# EAGLE design MiniDuino (EAGLE 6.5.0)
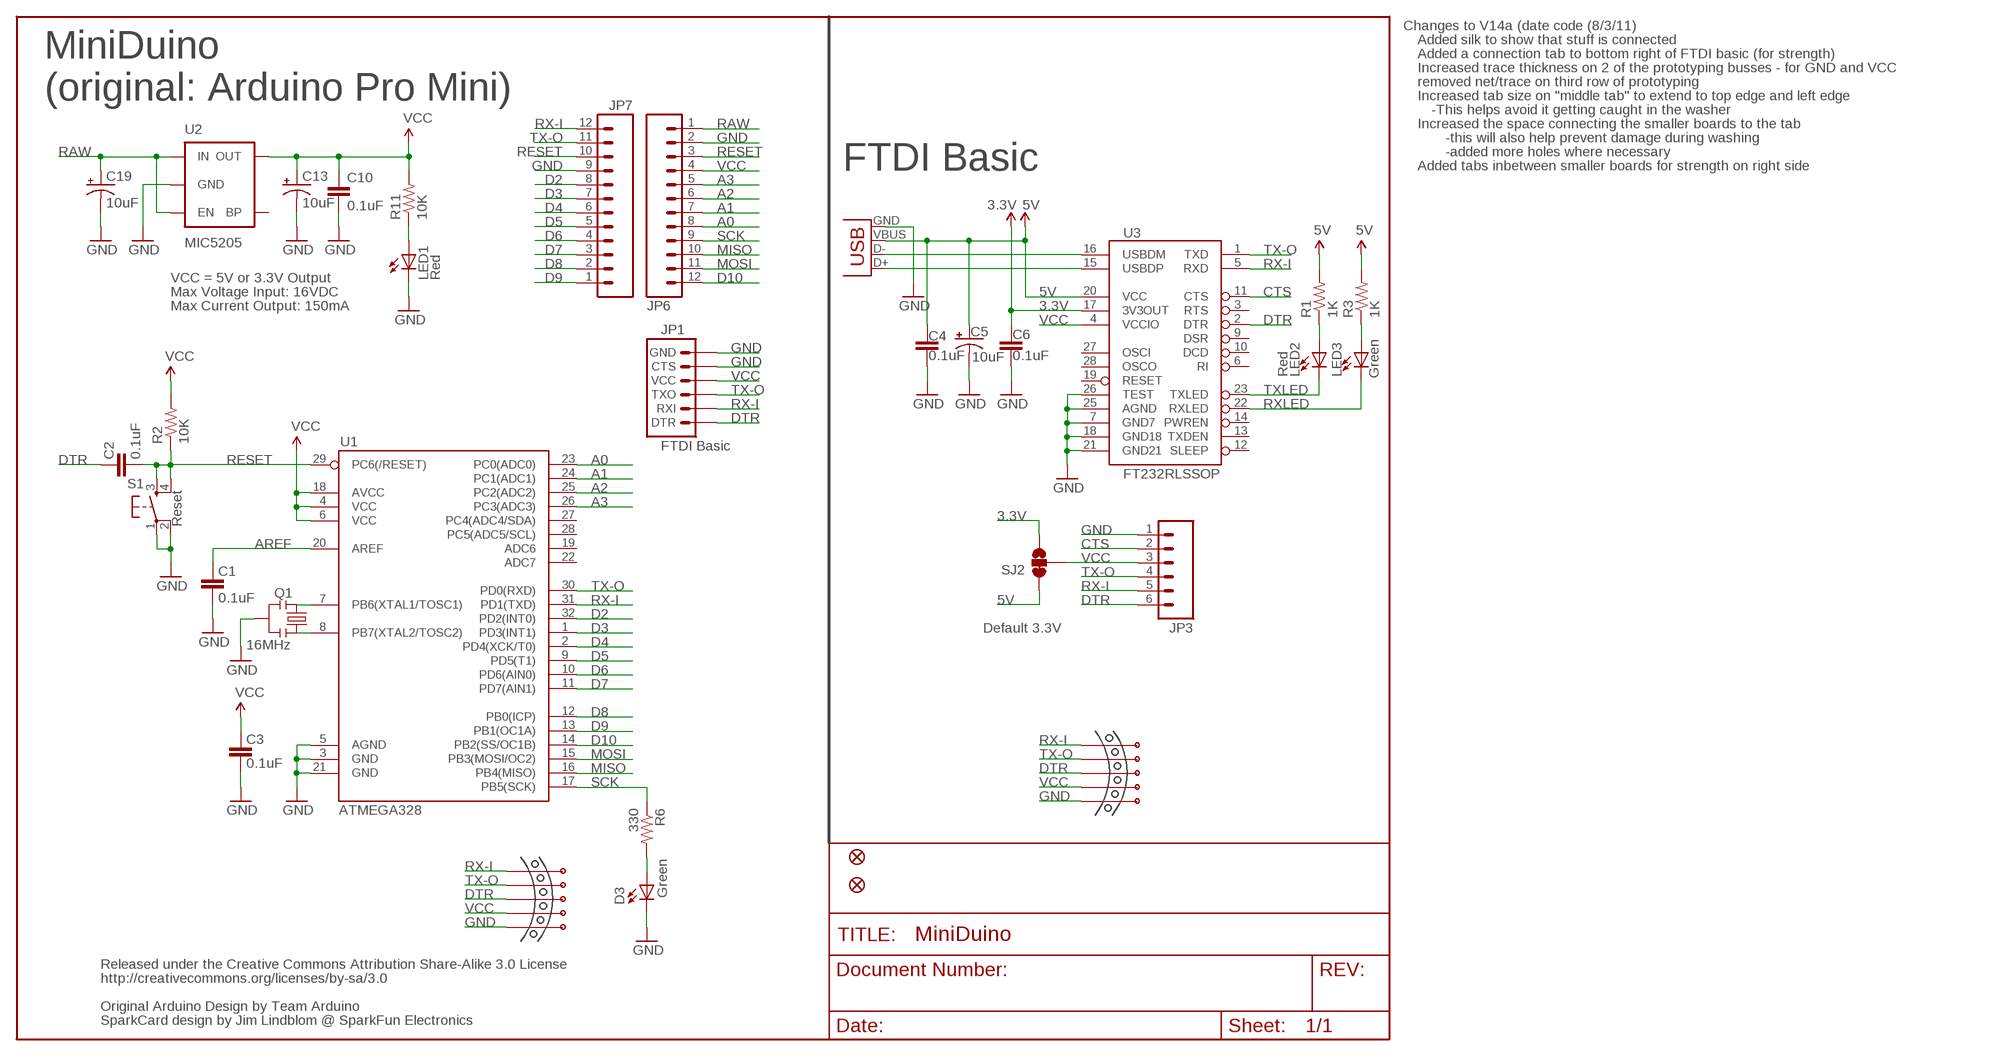
[diagram p0: schematic, sheet 1]

## Parts
C1  0.1uF  CAP0402-CAP  [0402-CAP]
C2  0.1uF  CAP0402-CAP  [0402-CAP]
C3  0.1uF  CAP0402-CAP  [0402-CAP]
C4  0.1uF  CAP0402-CAP  [0402-CAP]
C5  10uF  CAP_POL1206  [EIA3216]
C6  0.1uF  CAP0402-CAP  [0402-CAP]
C10  0.1uF  CAP0402-CAP  [0402-CAP]
C13  10uF  CAP_POL1206  [EIA3216]
C19  10uF  CAP_POL1206  [EIA3216]
D3  Green  LED0603  [LED-0603]
JP1  FTDI Basic  ARDUINO_SERIAL_PROGRAMPTH  [1X06]
JP3  M06SIP  [1X06]
JP6  M12PTH  [1X12]
JP7  M12PTH  [1X12]
JP16  FIDUCIAL1X2.5  [FIDUCIAL-1X2.5]
JP19  FIDUCIAL1X2.5  [FIDUCIAL-1X2.5]
LED1  Red  LED0603  [LED-0603]
LED2  Red  LED0603  [LED-0603]
LED3  Green  LED0603  [LED-0603]
Q1  16MHz  RESONATORSMD  [RESONATOR-SMD]
R1  1K  RESISTOR0402-RES  [0402-RES]
R2  10K  RESISTOR0402-RES  [0402-RES]
R3  1K  RESISTOR0402-RES  [0402-RES]
R6  330  RESISTOR0402-RES  [0402-RES]
R11  10K  RESISTOR0402-RES  [0402-RES]
S1  Reset  TAC_SWITCHSMD  [TACTILE_SWITCH_SMD]
SJ2  SOLDERJUMPER_2WAYS  [SJ_3]
U1  ATMEGA328  ATMEGA168  [TQFP32-08]
U2  MIC5205  V_REG_LDOSMD  [SOT23-5]
U3  FT232RLSSOP  [SSOP28DB]
U$22  MOUSE-BITE-5  [MOUSE-BITE-5]
U$23  MOUSE-BITE-5  [MOUSE-BITE-5]
X2  USB-SMD-NS  [USB-MINIB-NOSTOP]

## Nets
3.3V [power]: C6.1 SJ2.3 U3.17(3V3OUT)
5V: C4.1 C5.A(+) R1.2 R3.2 SJ2.1 U3.20(VCC) X2.VBUS
A0: JP6.8 U1.23(PC0(ADC0))
A1: JP6.7 U1.24(PC1(ADC1))
A2: JP6.6 U1.25(PC2(ADC2))
A3: JP6.5 U1.26(PC3(ADC3))
AREF: C1.2 U1.20(AREF)
CTS: JP3.2 U3.11(CTS)
D2: JP7.8 U1.32(PD2(INT0))
D3: JP7.7 U1.1(PD3(INT1))
D4: JP7.6 U1.2(PD4(XCK/T0))
D5: JP7.5 U1.9(PD5(T1))
D6: JP7.4 U1.10(PD6(AIN0))
D7: JP7.3 U1.11(PD7(AIN1))
D8: JP7.2 U1.12(PB0(ICP))
D9: JP7.1 U1.13(PB1(OC1A))
D10: JP6.12 U1.14(PB2(SS/OC1B))
DTR: C2.2 JP1.1(DTR) JP3.6 U3.2(DTR) U$22.P$3 U$23.P$3
GND [power]: C1.1 C3.1 C4.2 C5.C(-) C6.2 C10.2 C13.C(-) C19.C(-) D3.C JP1.5(CTS) JP1.6(GND) JP3.1 JP6.2 JP7.9 LED1.C Q1.2 S1.1 S1.2 U1.3(GND) U1.5(AGND) U1.21(GND) U2.2(GND) U3.7(GND7) U3.18(GND18) U3.21(GND21) U3.25(AGND) U3.26(TEST) U$22.P$5 U$23.P$5 X2.GND
MISO: JP6.10 U1.16(PB4(MISO))
MOSI: JP6.11 U1.15(PB3(MOSI/OC2))
N$1: Q1.1 U1.8(PB7(XTAL2/TOSC2))
N$2: Q1.3 U1.7(PB6(XTAL1/TOSC1))
N$3: LED2.A R1.1
N$4: LED3.A R3.1
N$7: D3.A R6.2
N$38: LED1.A R11.1
RAW [power]: C19.A(+) JP6.1 U2.1(IN) U2.3(EN)
RESET: C2.1 JP6.3 JP7.10 R2.1 S1.3 S1.4 U1.29(PC6(/RESET))
RX-I: JP1.2(RXI) JP3.5 JP7.12 U1.31(PD1(TXD)) U3.5(RXD) U$22.P$1 U$23.P$1
RXLED: LED3.C U3.22(RXLED)
SCK: JP6.9 R6.1 U1.17(PB5(SCK))
TX-O: JP1.3(TXO) JP3.4 JP7.11 U1.30(PD0(RXD)) U3.1(TXD) U$22.P$2 U$23.P$2
TXLED: LED2.C U3.23(TXLED)
USB_D+: U3.15(USBDP) X2.D+
USB_D-: U3.16(USBDM) X2.D-
VCC: C3.2 C10.1 C13.A(+) JP1.4(VCC) JP3.3 JP6.4 R2.2 R11.2 SJ2.2 U1.4(VCC) U1.6(VCC) U1.18(AVCC) U2.5(OUT) U3.4(VCCIO) U$22.P$4 U$23.P$4
Unconnected: U1.19(ADC6) U1.22(ADC7) U1.27(PC4(ADC4/SDA)) U1.28(PC5(ADC5/SCL)) U2.4(BP) U3.3(RTS) U3.6(RI) U3.9(DSR) U3.10(DCD) U3.12(SLEEP) U3.13(TXDEN) U3.14(PWREN) U3.19(RESET) U3.27(OSCI) U3.28(OSCO)

## Notes on the sheet
- Changes to V14a (date code (8/3/11)
- Added silk to show that stuff is connected
- Added a connection tab to bottom right of FTDI basic (for strength)
- Increased trace thickness on 2 of the prototyping busses - for GND and VCC
- removed net/trace on third row of prototyping
- MiniDuino
  (original: Arduino Pro Mini)
- Increased tab size on "middle tab" to extend to top edge and left edge
- -This helps avoid it getting caught in the washer
- Increased the space connecting the smaller boards to the tab
- -this will also help prevent damage during washing
- -added more holes where necessary
- FTDI Basic | Added tabs inbetween smaller boards for strength on right side
- VCC = 5V or 3.3V Output
- Max Voltage Input: 16VDC
- Max Current Output: 150mA
- Default 3.3V
- Released under the Creative Commons Attribution Share-Alike 3.0 License
- http://creativecommons.org/licenses/by-sa/3.0
- Original Arduino Design by Team Arduino
- SparkCard design by Jim Lindblom @ SparkFun Electronics

## Library data of the parts
C1-C4 C6 C10 = SparkFun:CAP: Capacitor Standard 0603 ceramic capacitor, and 0.1" leaded capacitor.
C5 C13 C19 = SparkFun:CAP_POL: Capacitor Polarized These are standard SMD and PTH capacitors. Normally 10uF, 47uF, and 100uF in electrolytic and tantalum varieties. Always verify the external diameter of the through hole cap, it varies with capacity, voltage, and manufacturer. The EIA devices should be standard.
D3 LED1-LED3 = SparkFun:LED: LEDs Standard schematic elements and footprints for 5mm, 3mm, 1206, and 0603 sized LEDs. 5mm - Spark Fun Electronics SKU : COM-00529 (and others)
JP1 = SparkFun:ARDUINO_SERIAL_PROGRAM
JP3 = SparkFun:M06: Header 6 Standard 6-pin 0.1" header. Use with straight break away headers (SKU : PRT-00116), right angle break away headers (PRT-00553), swiss pins (PRT-00743), machine pins (PRT-00117), and female headers (PRT-00115). Molex polarized connector foot print use with SKU : PRT-08094 with associated crimp pins and housings. NOTES ON THE VARIANTS LOCK and LOCK_LONGPADS... This footprint was designed to help hold the alignment of a through-hole component (i.e. 6-pin header) while soldering it into place. You may notice that each hole has been shifted either up or down by 0.005 of an inch from it's more standard position (which is a perfectly straight line). This slight alteration caused the pins (the squares in the middle) to touch the edges of the holes. Because they are alternating, it causes a "brace" to hold the component in place. 0.005 has proven to be the perfect amount of "off-center" position when using our standard breakaway headers. Although looks a little odd when you look at the bare footprint, once you have a header in there, the alteration is very hard to notice. Also, if you push a header all the way into place, it is covered up entirely on the bottom side. This idea of altering the position of holes to aid alignment will be further integrated into the Sparkfun Library for other footprints. It can help hold any component with 3 or more connection pins.
JP6 JP7 = SparkFun:M12: Header 12 Standard 12-pin 0.1" header. Use with straight break away headers (SKU : PRT-00116), right angle break away headers (PRT-00553), swiss pins (PRT-00743), machine pins (PRT-00117), and female headers (PRT-00115).
JP16 JP19 = abes:FIDUCIAL: Fiducial Alignment Points Various fiducial points for machine vision alignment.
Q1 = SparkFun:RESONATOR: Resonator Small SMD resonator. This is the itty bitty 10/20MHz resonators with built in caps. CSTCE10M0G55 and CSTCE20M0V53. Footprint has been reviewed closely but hasn't been tested yet.
R1-R3 R6 R11 = SparkFun:RESISTOR: Resistor Basic schematic elements and footprints for 0603, 1206, and PTH resistors.
S1 = SparkFun:TAC_SWITCH: Momentary Switch Button commonly used for reset or general input. Spark Fun Electronics SKU : COM-00097
SJ2 = SparkFun:SOLDERJUMPER_2WAY: Solder Jumper 2 way solder jumper
U1 = SparkFun:ATMEGA168
U2 = SparkFun:V_REG_LDO: Voltage Regulator LDO Standard 150mA LDO voltage regulator in SOT-23 layout. Micrel part MIC5205. BP (by-pass) pin is used to lower output noise with 470pF cap.
U3 = SparkFun:FT232RL: USB UART FT232RL 4th Generation USB UART (USB <-> Serial) Controller. Spark Fun Electronics SKU : COM-00650
U$22 U$23 = SparkFun:MOUSE-BITE-5
X2 = SparkFun:USB: USB Connectors USB-B-PTH is fully proven SKU : PRT-00139 USB-miniB is fully proven SKU : PRT-00587 USB-A-PCB is untested. USB-A-H is throughly reviewed, but untested. Spark Fun Electronics SKU : PRT-00437 USB-B-SMT is throughly reviewed, but untested. Needs silkscreen touching up. USB-A-S has not been used/tested USB-MB-H has not been used/tested

## Net classes
0 default: width 0.203 mm
1 power: width 0.254 mm

## Board
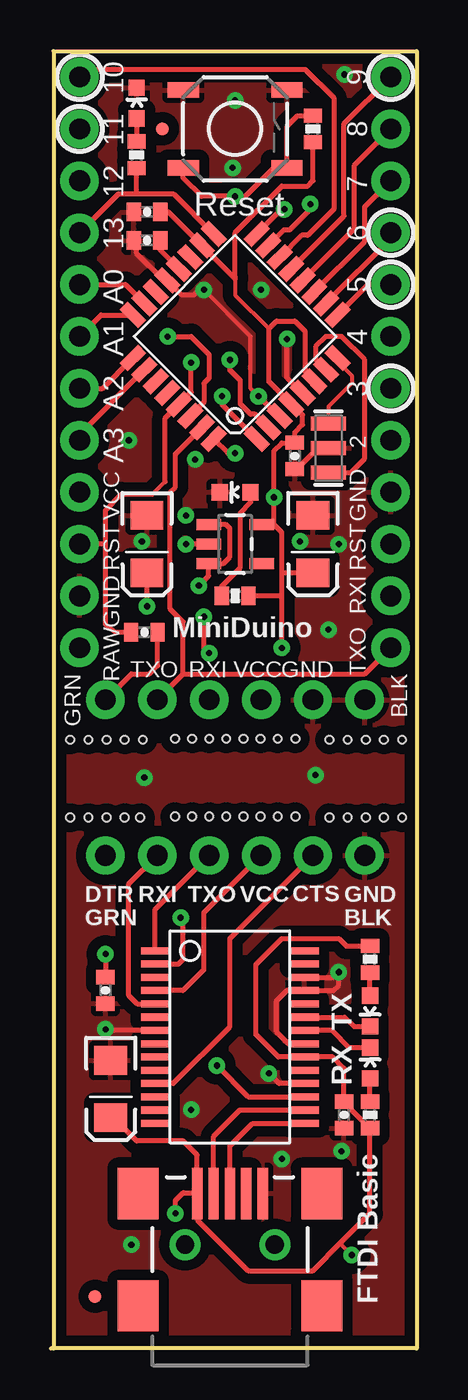
[diagram p1: board, top side]
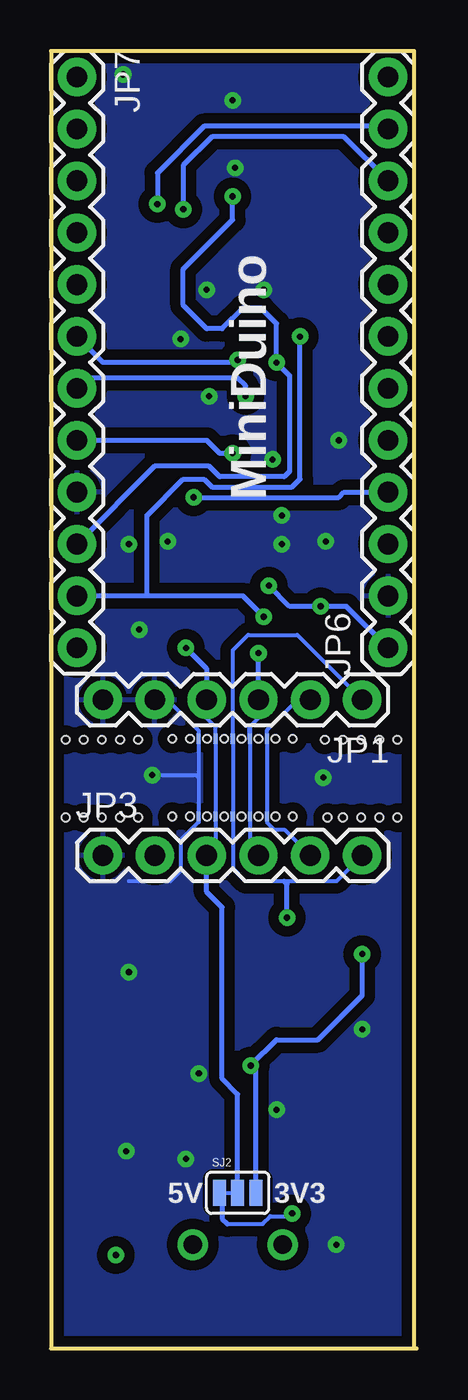
[diagram p2: board, bottom side, seen from below]

Size 17.91 x 63.5 mm. Coordinates in mm from the lower left corner, seen from the top.
Outline: 0.13,0 0.13,63.5 17.91,63.5 17.91,0 0,0
Copper layers (1*16): Top 0.035mm / dielectric 1.5mm / Bottom 0.035mm
Design rules "SparkFun *": minimum track width 8mil, minimum drill 20mil, track to track 8mil, track to pad 8mil, pad to pad 8mil, via to via 8mil, smd to smd 8mil, copper to edge 8mil, drill to drill 8mil, minimum pad ring 12mil, minimum via ring 10mil, stop-mask expansion 4mil, vias tented up to drill 20mil, thermal gap 10mil
Holes 0.38 mm at 0.94,29.79 1.83,29.79 2.72,29.79 3.61,29.79 4.5,29.79 0.94,25.98 1.83,25.98 2.72,25.98 3.61,25.98 4.37,25.98 17.2,29.79 16.31,29.79 15.42,29.79 14.53,29.79 13.64,29.79 17.2,25.98 16.31,25.98 15.42,25.98 14.53,25.98 13.64,25.98

### Footprints (pad centres in the part's own frame; a part is rotated, then mirrored left to right if it is on the bottom)
0402-CAP = smd 0.7 x 0.9: 1 -0.65,0; 2 0.65,0
EIA3216 = smd 1.4 x 1.6: A 1.4,0; C -1.4,0
LED-0603 = smd 0.8 x 0.8: A 0,-0.75; C 0,0.75
1X06 = drill 1.016 pad 1.88: 1 0,0; 2 2.54,0; 3 5.08,0; 4 7.62,0; 5 10.16,0; 6 12.7,0
1X12 = drill 1.016 pad 1.88: 1 0,0; 2 2.54,0; 3 5.08,0; 4 7.62,0; 5 10.16,0; 6 12.7,0; 7 15.24,0; 8 17.78,0; 9 20.32,0; 10 22.86,0; 11 25.4,0; 12 27.94,0
FIDUCIAL-1X2.5 = smd 0.635 x 0.635: 1 0,0
RESONATOR-SMD = smd 0.7 x 1.7: 1 -1.2,0; 2 0,0; 3 1.2,0
0402-RES = smd 0.7 x 0.9: 1 -0.65,0; 2 0.65,0
TACTILE_SWITCH_SMD = smd 1.524 x 0.762: 1 -2.54,1.905; 2 2.54,1.905; 3 -2.54,-1.905; 4 2.54,-1.905
SJ_3 = smd 0.635 x 1.27: 1 -0.889,0; 2 0,0; 3 0.889,0
TQFP32-08 = smd 1.27 x 0.559: 1 -4.293,2.8; 2 -4.293,2; 3 -4.293,1.2; 4 -4.293,0.4; 5 -4.293,-0.4; 6 -4.293,-1.2; 7 -4.293,-2; 8 -4.293,-2.8; 17 4.293,-2.8; 18 4.293,-2; 19 4.293,-1.2; 20 4.293,-0.4; 21 4.293,0.4; 22 4.293,1.2; 23 4.293,2; 24 4.293,2.8 | smd 0.559 x 1.27: 9 -2.8,-4.293; 10 -2,-4.293; 11 -1.2,-4.293; 12 -0.4,-4.293; 13 0.4,-4.293; 14 1.2,-4.293; 15 2,-4.293; 16 2.8,-4.293; 25 2.8,4.293; 26 2,4.293; 27 1.2,4.293; 28 0.4,4.293; 29 -0.4,4.293; 30 -1.2,4.293; 31 -2,4.293; 32 -2.8,4.293
SOT23-5 = smd 0.55 x 1.2: 1 -0.95,-1.3; 2 0,-1.3; 3 0.95,-1.3; 4 0.95,1.3; 5 -0.95,1.3
SSOP28DB = smd 0.348 x 1.397: 1 -4.225,-3.656; 2 -3.575,-3.656; 3 -2.925,-3.656; 4 -2.275,-3.656; 5 -1.625,-3.656; 6 -0.975,-3.656; 7 -0.325,-3.656; 8 0.325,-3.656; 9 0.975,-3.656; 10 1.625,-3.656; 11 2.275,-3.656; 12 2.925,-3.656; 13 3.575,-3.656; 14 4.225,-3.656; 15 4.225,3.656; 16 3.575,3.656; 17 2.925,3.656; 18 2.275,3.656; 19 1.625,3.656; 20 0.975,3.656; 21 0.325,3.656; 22 -0.325,3.656; 23 -0.975,3.656; 24 -1.625,3.656; 25 -2.275,3.656; 26 -2.925,3.656; 27 -3.575,3.656; 28 -4.225,3.656
MOUSE-BITE-5 = smd 0.203 x 0.508 bottom: P$1 -1.689,0; P$2 -0.851,0; P$3 -0.013,0; P$4 0.826,0; P$5 1.664,0 | hole 0.381: -2.108,0; -1.27,0; -0.432,0; 0.406,0; 1.245,0; 2.083,0; -2.946,0; 2.946,0
USB-MINIB-NOSTOP = smd 2.5 x 0.5: D+ 2.5,0; D- 2.5,0.8; GND 2.5,-1.6; ID 2.5,-0.8; VBUS 2.5,1.6 | smd 2.5 x 2: G1 -3,-4.5; G2 -3,4.5; G3 2.5,4.5; G4 2.5,-4.5 | drill 0.9 pad 0.8: H1 0,2.2 | drill 0.9 pad 0.787: H2 0,-2.2

### Placement (x,y rotation side)
C1  4.7,54.23 0 top
C2  4.57,35.05 0 top
C3  4.7,55.63 0 top
C4  14.35,11.43 270 top
C5  2.92,12.7 270 top
C6  2.67,17.53 270 top
C10  11.94,43.69 270 top
C13  12.83,39.37 270 top
C19  4.7,39.37 270 top
D3  4.19,60.96 0 top
JP1  2.67,31.75 180 bottom
JP3  15.37,24.13 0 bottom
JP6  1.4,34.29 90 bottom
JP7  16.64,62.23 270 bottom
JP16  2.16,2.54 0 top
JP19  5.46,59.69 0 top
LED1  9.02,41.91 90 top
LED2  15.62,16.51 180 top
LED3  15.62,13.97 0 top
Q1  13.59,44.07 270 top
R1  15.62,19.05 90 top
R2  12.83,59.69 270 top
R3  15.62,11.43 270 top
R6  4.19,58.42 90 top
R11  9.02,36.83 0 top
S1  9.02,59.69 0 top
SJ2  8.76,7.62 0 bottom
U1  9.02,49.53 135 top
U2  9.02,39.37 270 top
U3  8.76,15.24 270 top
U$22  9.02,29.84 0 top
U$23  9.02,26.04 0 top
X2  8.76,5.08 90 top

### Tracks (layer width: path | path; a pad name or v marks a point on that pad's centre or on a via)
3.3V  (via drill 0.3)
  Top 0.254: U3.17 9.66,12.31 v8.13,13.84 | v2.67,19.3 C6.1
  Bottom 0.254: SJ2.3 7.87,13.59 v8.13,13.84 6.86,15.11 4.83,15.11 2.67,17.27 v2.67,19.3
5V  (via drill 0.3)
  Top 0.203: v14.73,4.57 14.22,5.08 14.22,5.21
  Top 0.254: C5.A 3.05,11.3 4.19,10.16 6.48,10.16 7.16,9.47 X2.VBUS | R1.2 14.46,19.7 14.1,20.07 11.3,20.07 10.03,18.8 10.03,15.37 11.13,14.27 U3.20 13.8,14.27 14.35,13.72 C4.1 14.35,12.05 R3.2 15.62,6.6 14.22,5.21 12.83,3.81 9.65,3.81 7.16,6.3 X2.VBUS | v6.1,6.6 6.1,7.24 6.48,7.62 7.12,7.62 X2.VBUS
  Bottom 0.203: 9.27,6.1 7.54,6.1 7.16,6.48 6.22,6.48 v6.1,6.6 | 9.53,7.62 8.76,7.62
  Bottom 0.254: SJ2.1 9.53,7.62 9.53,6.35 9.27,6.1
A0
  Top 0.203: JP6.8 1.38,52.08
  Top 0.254: JP6.8 3.65,52.07 U1.23
A1
  Top 0.254: U1.24 2.45,50.59 JP6.7
A2
  Top 0.254: U1.25 2.52,46.99 JP6.6
A3
  Top 0.254: U1.26 1.4,44.74 JP6.5
AREF
  Top 0.254: C1.2 5.35,53.76 U1.20
CTS
  Top 0.254: U3.11 5.98,12.96 8.76,15.75 8.76,20.07 JP3.2
D2  (via drill 0.3)
  Top 0.254: v9.02,43.81 8.66,43.81 U1.32
  Bottom 0.254: JP7.8 10.29,44.45 9.65,43.81 v9.02,43.81
D3  (via drill 0.3)
  Top 0.254: v8.38,46.61 8.38,46.2 U1.1
  Bottom 0.254: v8.38,46.61 8.38,47.12 8.76,47.5 16.13,47.5 JP7.7
D4  (via drill 0.3)
  Top 0.254: v8.76,48.39 8.76,47.88 9.27,47.37 9.27,46.23 9.78,45.72 10,45.72 U1.2
  Bottom 0.254: JP7.6 15.37,48.26 8.89,48.26 v8.76,48.39
D5
  Top 0.254: U1.9 15.52,52.07 JP7.5
D6
  Top 0.254: U1.10 16.64,54.32 JP7.4
D7
  Top 0.254: U1.11 15.37,54.18 15.37,55.88 JP7.3
D8
  Top 0.254: U1.12 14.86,54.81 14.86,57.91 JP7.2
D9
  Top 0.254: U1.13 14.35,55.43 14.35,59.94 JP7.1
D10
  Top 0.254: JP6.12 1.78,62.61 12.45,62.61 13.84,61.21 13.84,55.75 12.57,54.48 12.27,54.48 U1.14
DTR  (via drill 0.3)
  Top 0.254: JP1.1 3.94,33.02 4.83,33.02 5.22,33.42 C2.2 | U3.2 6.24,18.82 6.48,19.05 6.48,20.95 v6.35,21.08
  Bottom 0.203: JP1.1 5.84,34.92 8.26,34.92 9,34.18 U$22.P$3 U$23.P$3 9,23.48 8.38,22.86 6.48,22.86 3.94,22.86 JP3.6
  Bottom 0.254: v6.35,21.08 6.35,22.73 6.48,22.86
GND  (via drill 0.3)
  Top 0.203: 13.07,17.53 13.08,17.52 | v7.49,51.82 9.78,49.53 9.78,46.99 v10.16,46.61
  Top 0.254: C3.1 3.94,55.63 | 3.94,54.04 3.94,54.23 | C10.2 12.05,43.04 13.08,44.07 Q1.2 | U2.2 v6.6,39.37 | U3.7 2.72,15.56 v2.67,15.62 | U3.26 13.85,18.16 v14.1,18.41 14.1,17.78 13.83,17.52 13.08,17.52 U3.25 | U3.18 11.17,12.96 v10.67,13.46 | v7.49,51.82 7.24,51.82 6.98,51.56 6.42,51.56 U1.21 5.5,52.28 4.19,53.59 4.19,54.09 C1.1 | U1.5 12.28,46.78 11.56,47.5 v11.56,49.4 | U1.3 11.12,45.65 v10.16,46.61 | U3.21 11.63,14.91 11.05,15.49 11.05,17.02 11.56,17.53 13.07,17.53
  Bottom 0.203: 12.19,31.75 10.68,30.24 U$22.P$5 10.68,27.94 | 16.65,41.92 JP7.9 | 14.1,22.86 12.07,22.86 11.56,23.37 11.56,24.89 10.68,25.77 U$23.P$5 10.68,27.94 | v12.95,28.07 10.81,28.07 10.68,27.94
  Bottom 0.254: 12.19,31.75 JP1.5
  other vias: 9.02,61.09 13.59,35.18 7.06,43.51 4.44,39.5 14.1,39.37 12.19,39.5 3.94,5.08 11.3,9.27 14.22,9.65 6.86,11.68 8.89,57.78 14.38,62.36 4.57,27.94 10.29,51.82 3.81,44.45 6.6,40.77
  pour Bottom (isolate 0.508): 0.13,63.5 0.13,0 17.91,0 17.91,63.5
  pour Top (isolate 0.508): 0.13,63.5 0.13,0 17.91,0 17.91,63.5
MISO  (via drill 0.3)
  Top 0.254: U1.16 11.28,55.75 v11.43,55.75
  Bottom 0.254: v11.43,55.75 11.43,57.91 10.03,59.31 3.56,59.31 JP6.10
MOSI  (via drill 0.3)
  Top 0.254: U1.15 11.4,54.74 11.68,54.74 12.7,55.75 v12.7,56.01
  Bottom 0.254: JP6.11 1.52,59.82 10.41,59.82 12.7,57.53 v12.7,56.01
N$1
  Top 0.203: U1.8 14.03,48.33 14.73,47.62 14.73,47.24 13.59,46.1 Q1.1
N$2
  Top 0.254: Q1.3 14.68,42.87 15.37,43.56 15.37,48.39 14.22,49.53 13.46,49.53 12.95,49.02 12.95,48.42 U1.7
N$3
  Top 0.254: LED2.A R1.1
N$4
  Top 0.254: R3.1 LED3.A
N$7
  Top 0.254: D3.A R6.2
N$38
  Top 0.254: R11.1 8.37,37.32 9.27,38.23 9.27,40.89 9.78,41.4 9.78,41.91 LED1.A
RAW  (via drill 0.3)
  Top 0.254: v4.7,36.32 C19.A | U2.1 8.58,40.32 8.76,40.13 8.76,38.73 8.45,38.42 U2.3 7.72,37.82 v7.24,37.34
  Bottom 0.254: JP6.1 3.43,36.32 v4.7,36.32 6.22,36.32 v7.24,37.34
RESET  (via drill 0.3)
  Top 0.203: 3.43,41.78 4.95,41.78 5.59,42.42
  Top 0.254: R2.1 12.81,60.33 12.07,60.33 11.56,59.82 S1.4 10.92,57.78 9.53,56.39 v9.02,56.39 7.37,56.39 6.48,57.28 S1.3 | v6.86,48.26 6.86,46.8 U1.29 5.59,45.53 5.59,42.42 | C2.1 3.17,35.05 2.67,35.43 2.67,39.37 | 2.67,39.37 JP6.3 | 2.67,39.37 2.67,41.02 3.43,41.78
  Bottom 0.254: v9.02,56.39 9.02,55.24 11.43,52.83 11.43,51.05 10.29,49.91 9.53,49.91 8.51,50.93 7.62,50.93 6.86,50.16 v6.86,48.26 6.22,47.62 6.22,42.93 6.48,42.67 9.65,42.67 10.16,43.18 12.83,43.18 JP7.10
RX-I
  Top 0.254: JP7.12 15.37,33.02 6.48,33.02 | 6.48,33.02 6.48,35.56 5.84,36.2 5.84,41.91 6.1,42.16 6.1,43.78 U1.31 | JP1.2 6.48,33.02 | U3.5 4.22,16.86 3.81,17.27 3.81,22.73 JP3.5
  Bottom 0.203: JP1.2 5.84,31.75 7.33,30.26 U$22.P$1 U$23.P$1 7.33,25.74 6.98,25.4 6.48,25.4 JP3.5
RXLED
  Top 0.254: U3.22 13.77,15.56 14.62,14.72 LED3.C
SCK
  Top 0.254: 4.19,56.52 3.3,56.52 JP6.9 | 4.19,56.52 R6.1 | 4.19,56.52 5.99,56.52 U1.17
TX-O  (via drill 0.3)
  Top 0.254: U1.30 7.49,46.31 7.49,47.24 7.75,47.5 7.75,48.64 6.86,49.53 v5.71,49.53 | U3.1 5.11,21.49 JP3.4 | 7.62,34.16 v7.75,34.04 7.49,34.29 v7.49,35.81
  Bottom 0.203: 8.17,30.44 7.75,30.86 JP1.3 | JP3.4 8.17,24.55 U$23.P$2 U$22.P$2
  Bottom 0.254: 13.21,36.83 JP7.11 | v5.71,49.53 5.71,42.55 6.1,42.16 10.03,42.16 10.41,42.55 11.43,42.55 13.21,40.77 13.21,36.83 | JP1.3 v7.75,34.04 | 13.21,36.83 8.51,36.83 v7.49,35.81 | U$22.P$2 8.17,30.44
TXLED
  Top 0.254: LED2.C 14.85,15.76 14.39,16.21 U3.23
USB_D+
  Top 0.254: X2.D+ 8.76,9.91 9.87,11.02 U3.15
USB_D-
  Top 0.254: U3.16 9.25,11.66 7.96,10.38 X2.D-
VCC  (via drill 0.3)
  Top 0.203: 9.02,52.36 9.02,51.56 10.67,49.91
  Top 0.254: C13.A 11.3,37.97 | 9.02,52.36 8.97,52.41 9.02,52.45 | R2.2 12.83,57.15 12.57,56.9 11.3,56.9 9.02,54.61 9.02,52.45 | 9.02,52.36 9.02,52.45 | 5.21,55.63 C3.2 5.75,55.63 | 10.92,40.32 U2.5 | 11.92,46.09 12.32,45.69 12.32,45.21 11.94,44.83 C10.1 11.95,44.34 11.94,44.32 11.3,44.32 10.92,43.94 v10.92,41.66 10.92,40.32 | 11.92,46.09 11.79,46.21 U1.4 | 10.92,40.32 11.3,39.94 11.3,37.97 | v11.3,34.29 11.3,36.83 | 11.3,36.83 11.3,37.97 | 11.3,36.83 R11.2 | U1.6 12.45,47.8 12.45,49.78 11.94,50.29 11.05,50.29 10.67,49.91 10.67,47.31 U1.4 | 5.75,55.63 | 5.75,55.63 U1.18 9.02,52.36 | 11.92,46.09 11.9,46.09 U1.4 | U3.4 6.47,17.52 7.49,18.54 7.49,21.34 JP3.3
  Bottom 0.203: 10.27,31.74 JP1.4 10.29,30.86 9.84,30.42 U$22.P$4 U$23.P$4 9.84,24.57 JP3.3
  Bottom 0.254: 10.92,41.53 v10.92,41.66 3.81,41.66 3.56,41.91 JP6.4 | v11.3,34.29 10.29,33.27 JP1.4 | SJ2.2 8.76,12.45 9.53,13.21 9.53,21.59 10.29,22.35 JP3.3

### Text on the board
tPlace: 10 | 9 | 11 | 8 | 12 | Reset | 7 | 13 | 6 | A0 | 5 | A1 | 4 | A2 | 3 | A3 | 2 | VCC | GND | RST | RST | GND | RXI | MiniDuino | RAW | TXO | TXO | RXI | VCC | GND | GRN | BLK | DTR | RXI | TXO | VCC | CTS | GND | GRN | BLK | TX | RX | FTDI Basic
bPlace: MiniDuino | 3V3 | 5V